# Altium schematic sheet SDRAM.SchDoc
size A4; DocumentNumber: 4; SheetNumber: 4; SheetTotal: 8
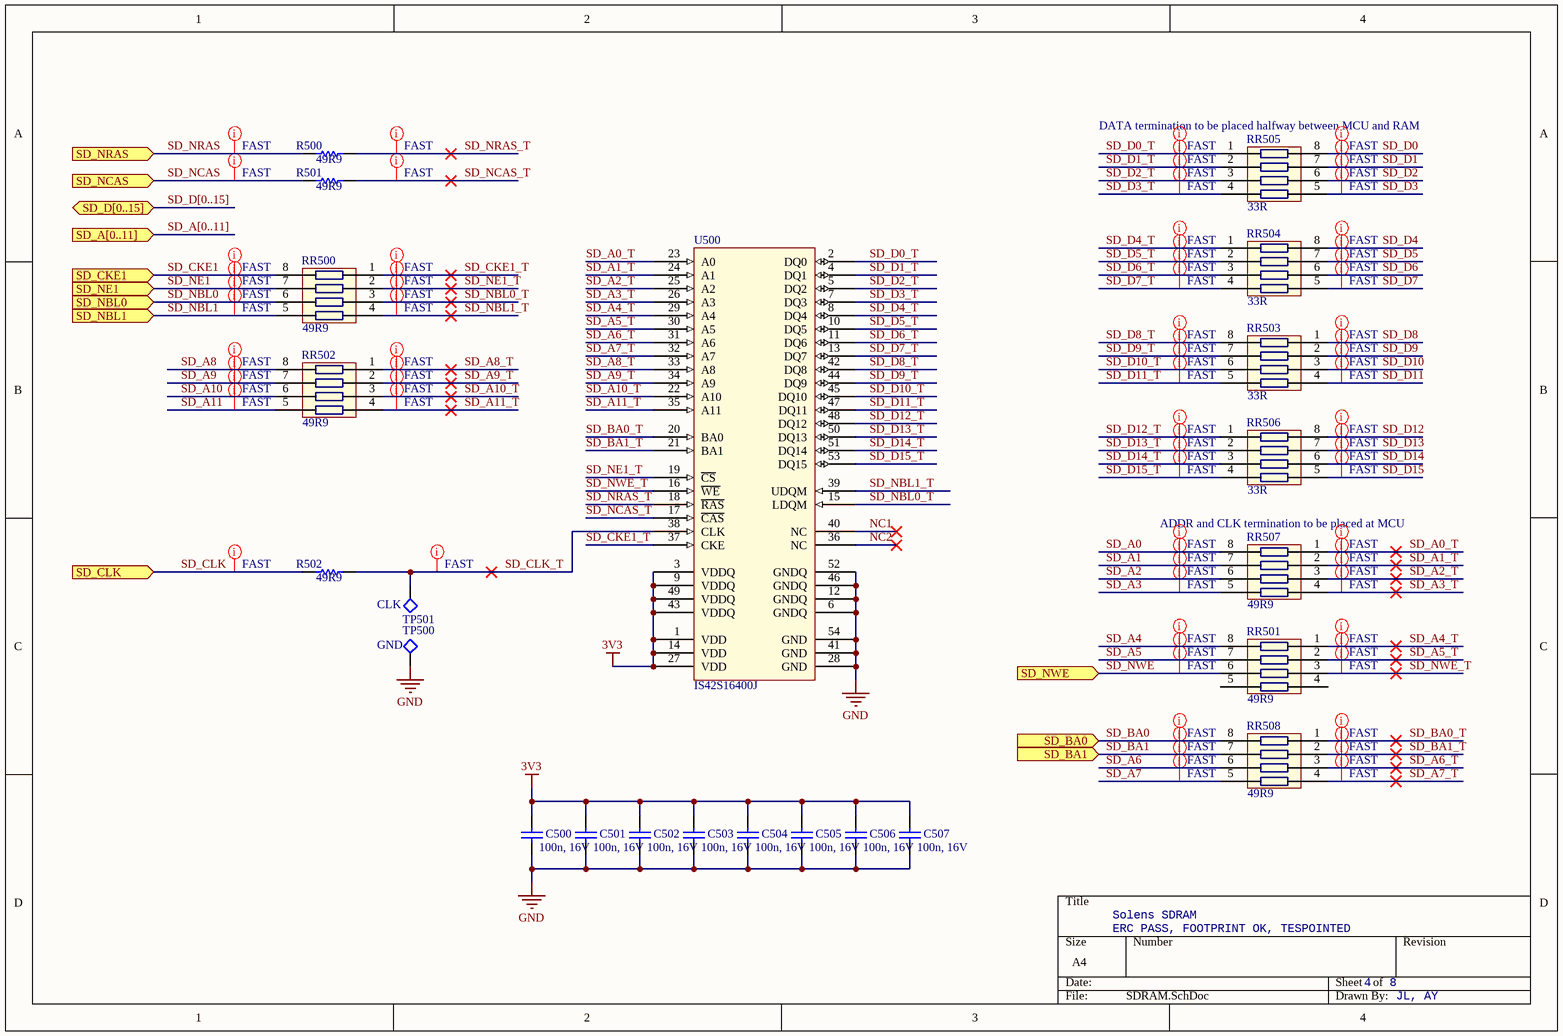
[diagram p0: SDRAM.SchDoc]

## Parts
C500  value 100n, 16V  [CAP_0402]  (hidden comment: 100n, 16V, 0402)
C501  value 100n, 16V  [CAP_0402]  (hidden comment: 100n, 16V, 0402)
C502  value 100n, 16V  [CAP_0402]  (hidden comment: 100n, 16V, 0402)
C503  value 100n, 16V  [CAP_0402]  (hidden comment: 100n, 16V, 0402)
C504  value 100n, 16V  [CAP_0402]  (hidden comment: 100n, 16V, 0402)
C505  value 100n, 16V  [CAP_0402]  (hidden comment: 100n, 16V, 0402)
C506  value 100n, 16V  [CAP_0402]  (hidden comment: 100n, 16V, 0402)
C507  value 100n, 16V  [CAP_0402]  (hidden comment: 100n, 16V, 0402)
R500  value 49R9  [RES_0805]  (hidden comment: 49R9, 1/8W, 0805)
R501  value 49R9  [RES_0805]  (hidden comment: 49R9, 1/8W, 0805)
R502  value 49R9  [RES_0805]  (hidden comment: 49R9, 1/8W, 0805)
RR500  value 49R9  [CAC-80P319X150-8M]  (hidden comment: CRA6S849.9ACT-ND)
RR501  value 49R9  [CAC-80P319X150-8M]  (hidden comment: CRA6S849.9ACT-ND)
RR502  value 49R9  [CAC-80P319X150-8M]  (hidden comment: CRA6S849.9ACT-ND)
RR503  value 33R  [CAC-80P319X150-8M]  (hidden comment: CRA6S833CT-ND)
RR504  value 33R  [CAC-80P319X150-8M]  (hidden comment: CRA6S833CT-ND)
RR505  value 33R  [CAC-80P319X150-8M]  (hidden comment: CRA6S833CT-ND)
RR506  value 33R  [CAC-80P319X150-8M]  (hidden comment: CRA6S833CT-ND)
RR507  value 49R9  [CAC-80P319X150-8M]  (hidden comment: CRA6S849.9ACT-ND)
RR508  value 49R9  [CAC-80P319X150-8M]  (hidden comment: CRA6S849.9ACT-ND)
TP500  VisibleNetName: GND  [TP_TINY]  (hidden comment: TP (DNP))
TP501  VisibleNetName: CLK  [TP_TINY]  (hidden comment: TP (DNP))
U500  IS42S16400J, TSOP-54  [TSOP80P1170X120-54N]  (value not drawn)

## Ports
SD_A[0..11] (in), SD_BA0 (in), SD_BA1 (in), SD_CKE1 (in), SD_CLK (in), SD_D[0..15] (bidir), SD_NBL0 (in), SD_NBL1 (in), SD_NCAS (in), SD_NE1 (in), SD_NRAS (in), SD_NWE (in)

## Nets
3V3: C500.1 C501.1 C502.1 C503.1 C504.1 C505.1 C506.1 C507.1 U500.1(VDD) U500.3(VDDQ) U500.9(VDDQ) U500.14(VDD) U500.27(VDD) U500.43(VDDQ) U500.49(VDDQ)
GND: C500.2 C501.2 C502.2 C503.2 C504.2 C505.2 C506.2 C507.2 TP500.1 U500.6(GNDQ) U500.12(GNDQ) U500.28(GND) U500.41(GND) U500.46(GNDQ) U500.52(GNDQ) U500.54(GND)
NC1: U500.40(NC)
NC2: U500.36(NC)
SD_A0: RR507.8(1B)
SD_A0_T: RR507.1(1A) U500.23(A0)
SD_A1: RR507.7(2B)
SD_A1_T: RR507.2(2A) U500.24(A1)
SD_A2: RR507.6(3B)
SD_A2_T: RR507.3(3A) U500.25(A2)
SD_A3: RR507.5(4B)
SD_A3_T: RR507.4(4A) U500.26(A3)
SD_A4: RR501.8(1B)
SD_A4_T: RR501.1(1A) U500.29(A4)
SD_A5: RR501.7(2B)
SD_A5_T: RR501.2(2A) U500.30(A5)
SD_A6: RR508.6(3B)
SD_A6_T: RR508.3(3A) U500.31(A6)
SD_A7: RR508.5(4B)
SD_A7_T: RR508.4(4A) U500.32(A7)
SD_A8: RR502.8(1B)
SD_A8_T: RR502.1(1A) U500.33(A8)
SD_A9: RR502.7(2B)
SD_A9_T: RR502.2(2A) U500.34(A9)
SD_A10: RR502.6(3B)
SD_A10_T: RR502.3(3A) U500.22(A10)
SD_A11: RR502.5(4B)
SD_A11_T: RR502.4(4A) U500.35(A11)
SD_BA0: RR508.8(1B) ; port SD_BA0
SD_BA0_T: RR508.1(1A) U500.20(BA0)
SD_BA1: RR508.7(2B) ; port SD_BA1
SD_BA1_T: RR508.2(2A) U500.21(BA1)
SD_CKE1: RR500.8(1B) ; port SD_CKE1
SD_CKE1_T: RR500.1(1A) U500.37(CKE)
SD_CLK: R502.1 ; port SD_CLK
SD_CLK_T: R502.2 TP501.1 U500.38(CLK)
SD_D0: RR505.8(1B)
SD_D0_T: RR505.1(1A) U500.2(DQ0)
SD_D1: RR505.7(2B)
SD_D1_T: RR505.2(2A) U500.4(DQ1)
SD_D2: RR505.6(3B)
SD_D2_T: RR505.3(3A) U500.5(DQ2)
SD_D3: RR505.5(4B)
SD_D3_T: RR505.4(4A) U500.7(DQ3)
SD_D4: RR504.8(1B)
SD_D4_T: RR504.1(1A) U500.8(DQ4)
SD_D5: RR504.7(2B)
SD_D5_T: RR504.2(2A) U500.10(DQ5)
SD_D6: RR504.6(3B)
SD_D6_T: RR504.3(3A) U500.11(DQ6)
SD_D7: RR504.5(4B)
SD_D7_T: RR504.4(4A) U500.13(DQ7)
SD_D8: RR503.1(1A)
SD_D8_T: RR503.8(1B) U500.42(DQ8)
SD_D9: RR503.2(2A)
SD_D9_T: RR503.7(2B) U500.44(DQ9)
SD_D10: RR503.3(3A)
SD_D10_T: RR503.6(3B) U500.45(DQ10)
SD_D11: RR503.4(4A)
SD_D11_T: RR503.5(4B) U500.47(DQ11)
SD_D12: RR506.8(1B)
SD_D12_T: RR506.1(1A) U500.48(DQ12)
SD_D13: RR506.7(2B)
SD_D13_T: RR506.2(2A) U500.50(DQ13)
SD_D14: RR506.6(3B)
SD_D14_T: RR506.3(3A) U500.51(DQ14)
SD_D15: RR506.5(4B)
SD_D15_T: RR506.4(4A) U500.53(DQ15)
SD_NBL0: RR500.6(3B) ; port SD_NBL0
SD_NBL0_T: RR500.3(3A) U500.15(LDQM)
SD_NBL1: RR500.5(4B) ; port SD_NBL1
SD_NBL1_T: RR500.4(4A) U500.39(UDQM)
SD_NCAS: R501.1 ; port SD_NCAS
SD_NCAS_T: R501.2 U500.17(~{CAS})
SD_NE1: RR500.7(2B) ; port SD_NE1
SD_NE1_T: RR500.2(2A) U500.19(~{CS})
SD_NRAS: R500.1 ; port SD_NRAS
SD_NRAS_T: R500.2 U500.18(~{RAS})
SD_NWE: RR501.6(3B) ; port SD_NWE
SD_NWE_T: RR501.3(3A) U500.16(~{WE})

Not connected (* = marked no-connect by the designer): RR501 4(4A) 5(4B)

## Buses and harness runs
bus SD_A[0..11] = port SD_A[0..11]
bus SD_D[0..15] = port SD_D[0..15]

## Layout directives
net class FAST: SD_A0, SD_A0_T, SD_A1, SD_A1_T, SD_A2, SD_A2_T, SD_A3, SD_A3_T, SD_A4, SD_A4_T, SD_A5, SD_A5_T, SD_A6, SD_A6_T, SD_A7, SD_A7_T, SD_A8, SD_A8_T, SD_A9, SD_A9_T, SD_A10, SD_A10_T, SD_A11, SD_A11_T, SD_BA0, SD_BA0_T, SD_BA1, SD_BA1_T, SD_CKE1, SD_CKE1_T, SD_CLK, SD_CLK_T, SD_D0, SD_D0_T, SD_D1, SD_D1_T, SD_D2, SD_D2_T, SD_D3, SD_D3_T, SD_D4, SD_D4_T, SD_D5, SD_D5_T, SD_D6, SD_D6_T, SD_D7, SD_D7_T, SD_D8, SD_D8_T, SD_D9, SD_D9_T, SD_D10, SD_D10_T, SD_D11, SD_D11_T, SD_D12, SD_D12_T, SD_D13, SD_D13_T, SD_D14, SD_D14_T, SD_D15, SD_D15_T, SD_NBL0, SD_NBL0_T, SD_NBL1, SD_NBL1_T, SD_NCAS, SD_NCAS_T, SD_NE1, SD_NE1_T, SD_NRAS, SD_NRAS_T, SD_NWE, SD_NWE_T

## Notes on the sheet
- (near RR505) DATA termination to be placed halfway between MCU and RAM
- (near RR507) ADDR and CLK termination to be placed at MCU
- Solens SDRAM
- ERC PASS, FOOTPRINT OK, TESPOINTED
- JL, AY

## Library data of the parts
C500-C507 = Cap: Capacitor; DigikeyPN: 587-3498-1-ND
R500-R502 = Res1: Resistor; DigikeyPN: 311-49.9CRCT-ND
RR500-RR508 = RES_ARR_4: 4 element resistor array
  RR500-RR502 RR507 RR508: DigikeyPN: CRA6S849.9ACT-ND
  RR503-RR506: DigikeyPN: CRA6S833CT-ND
TP500 TP501 = TP_TINY: Value: TP_TINY (DNP); DNP: DNP
U500 = IS42S16400J: 1Mb x 16 x 4 bank (64 Mbit) SDRAM; PartNumber: IS42S16400J; PackageName: TSOP-54; DigikeyPN: 706-1132-ND; Value: IS42S16400J